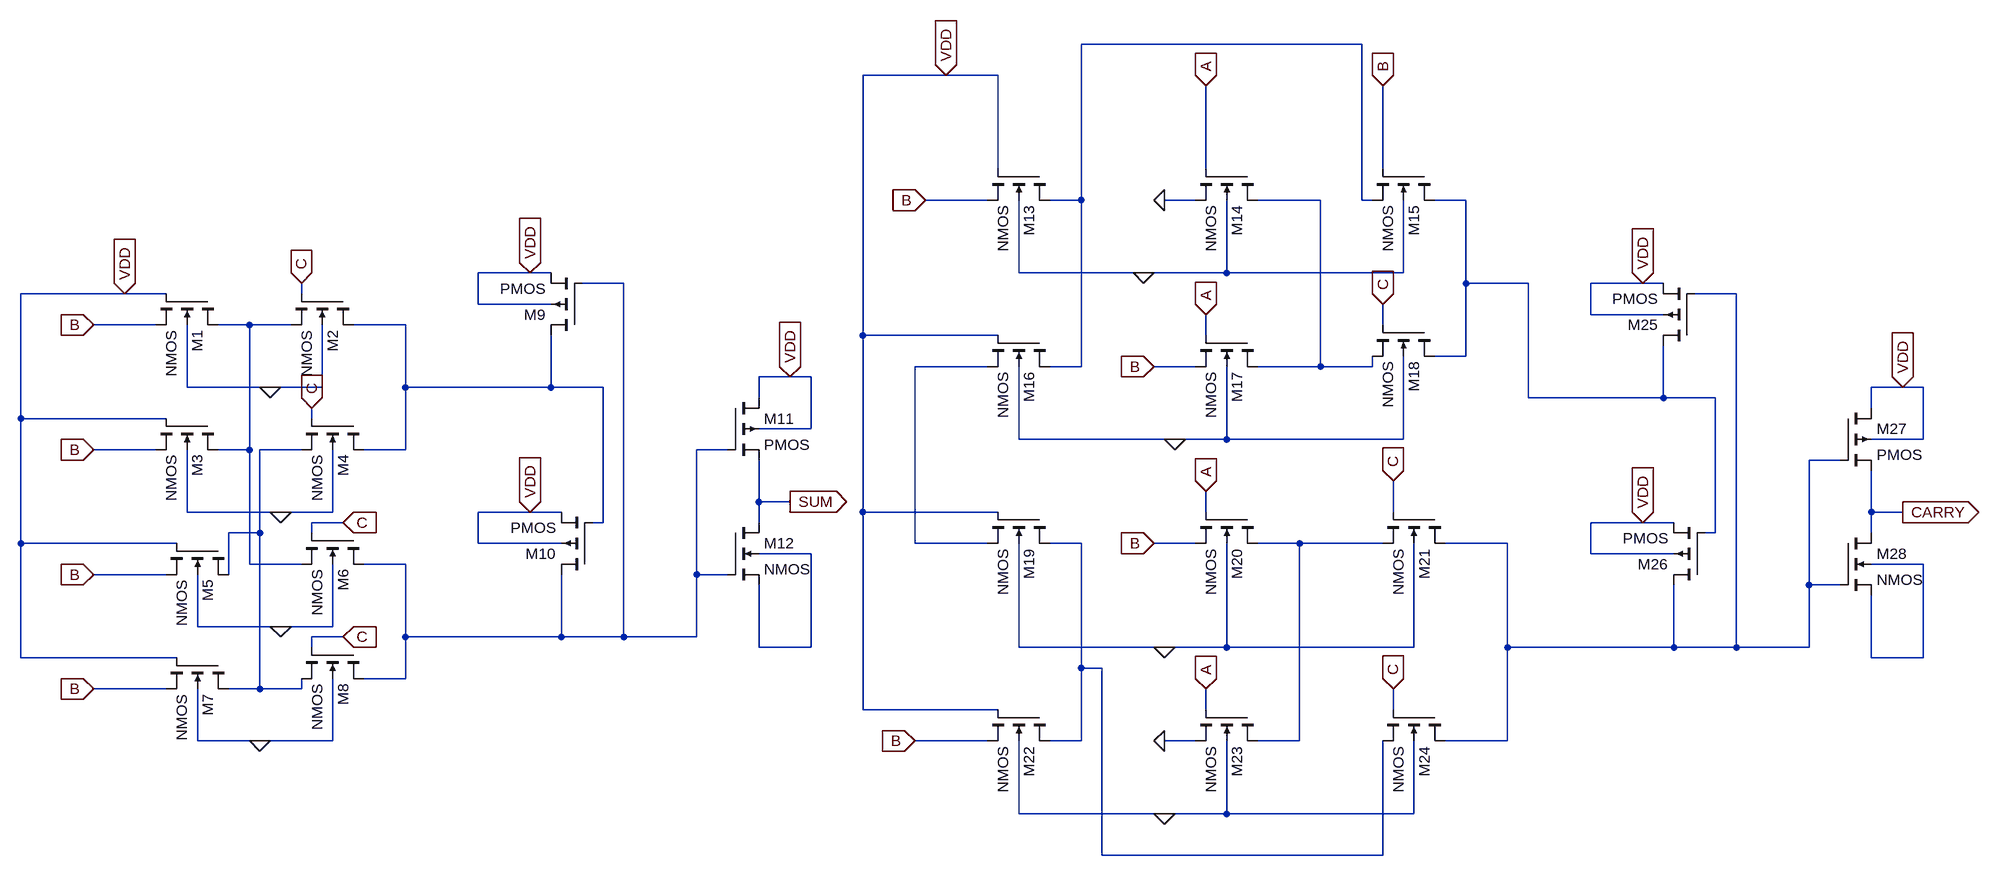
[diagram p0: schematic PTL.asc]
PTL.asc, the LTspice schematic file:
Version 4
SHEET 1 2920 916
WIRE 1968 -336 1536 -336
WIRE 1328 -288 1200 -288
WIRE 1408 -288 1328 -288
WIRE 1408 -144 1408 -288
WIRE 1728 -144 1728 -272
WIRE 2000 -144 2000 -272
WIRE 1392 -96 1296 -96
WIRE 1536 -96 1536 -336
WIRE 1536 -96 1488 -96
WIRE 1712 -96 1664 -96
WIRE 1904 -96 1808 -96
WIRE 1968 -96 1968 -336
WIRE 1984 -96 1968 -96
WIRE 2128 -96 2080 -96
WIRE 688 16 608 16
WIRE 720 16 688 16
WIRE 1440 16 1440 -96
WIRE 1632 16 1440 16
WIRE 1760 16 1760 -96
WIRE 1760 16 1632 16
WIRE 2032 16 2032 -96
WIRE 2032 16 1760 16
WIRE 832 32 768 32
WIRE 2128 32 2128 -96
WIRE 2224 32 2128 32
WIRE 2400 32 2320 32
WIRE 2432 32 2400 32
WIRE 64 48 -96 48
WIRE 128 48 64 48
WIRE 336 48 336 32
WIRE 2544 48 2480 48
WIRE 608 64 608 16
WIRE 720 64 608 64
WIRE 2320 80 2320 32
WIRE 2432 80 2320 80
WIRE 112 96 16 96
WIRE 256 96 208 96
WIRE 320 96 256 96
WIRE 496 96 416 96
WIRE 2000 96 2000 64
WIRE 1200 112 1200 -288
WIRE 1408 112 1200 112
WIRE 1728 112 1728 80
WIRE 2128 144 2128 32
WIRE 2128 144 2080 144
WIRE 1392 160 1280 160
WIRE 1536 160 1536 -96
WIRE 1536 160 1488 160
WIRE 1712 160 1648 160
WIRE 1904 160 1904 -96
WIRE 1904 160 1808 160
WIRE 1984 160 1984 144
WIRE 1984 160 1904 160
WIRE 1088 176 1040 176
WIRE 1120 176 1088 176
WIRE 160 192 160 96
WIRE 288 192 160 192
WIRE 368 192 368 96
WIRE 368 192 288 192
WIRE 496 192 496 96
WIRE 720 192 720 112
WIRE 720 192 496 192
WIRE 800 192 720 192
WIRE 2800 192 2752 192
WIRE 2832 192 2800 192
WIRE 1040 208 1040 176
WIRE 2224 208 2224 32
WIRE 2432 208 2432 128
WIRE 2432 208 2224 208
WIRE 2512 208 2432 208
WIRE 2752 224 2752 192
WIRE -96 240 -96 48
WIRE 128 240 -96 240
WIRE 352 240 352 224
WIRE 1120 256 1120 176
WIRE 1120 256 1040 256
WIRE 1440 272 1440 160
WIRE 1680 272 1440 272
WIRE 1760 272 1760 160
WIRE 1760 272 1680 272
WIRE 2032 272 2032 144
WIRE 2032 272 1760 272
WIRE 2832 272 2832 192
WIRE 2832 272 2752 272
WIRE 112 288 16 288
WIRE 256 288 256 96
WIRE 256 288 208 288
WIRE 336 288 272 288
WIRE 496 288 496 192
WIRE 496 288 432 288
WIRE 992 288 944 288
WIRE 2704 304 2656 304
WIRE 1040 368 1040 304
WIRE 1088 368 1040 368
WIRE 160 384 160 288
WIRE 304 384 160 384
WIRE 384 384 384 288
WIRE 384 384 304 384
WIRE 688 384 608 384
WIRE 736 384 688 384
WIRE 1200 384 1200 112
WIRE 1408 384 1200 384
WIRE 1728 384 1728 352
WIRE 2016 384 2016 336
WIRE 2752 384 2752 320
WIRE 2800 384 2752 384
WIRE 400 400 352 400
WIRE 800 400 800 192
WIRE 800 400 784 400
WIRE 1040 400 1040 368
WIRE 2400 400 2320 400
WIRE 2448 400 2400 400
WIRE 272 416 272 288
WIRE 272 416 224 416
WIRE 352 416 352 400
WIRE 2512 416 2512 208
WIRE 2512 416 2496 416
WIRE 2752 416 2752 384
WIRE -96 432 -96 240
WIRE 144 432 -96 432
WIRE 608 432 608 384
WIRE 736 432 608 432
WIRE 1280 432 1280 160
WIRE 1392 432 1280 432
WIRE 1536 432 1488 432
WIRE 1712 432 1648 432
WIRE 1872 432 1808 432
WIRE 2000 432 1872 432
WIRE 2192 432 2096 432
WIRE 1120 448 1040 448
WIRE 2320 448 2320 400
WIRE 2448 448 2320 448
WIRE 256 464 256 288
WIRE 336 464 256 464
WIRE 496 464 432 464
WIRE 2832 464 2752 464
WIRE 128 480 16 480
WIRE 224 480 224 416
WIRE 944 480 944 288
WIRE 992 480 944 480
WIRE 2656 496 2656 304
WIRE 2704 496 2656 496
WIRE 176 560 176 480
WIRE 304 560 176 560
WIRE 384 560 384 464
WIRE 384 560 304 560
WIRE 400 576 352 576
WIRE 496 576 496 464
WIRE 736 576 736 480
WIRE 736 576 496 576
WIRE 832 576 832 32
WIRE 832 576 736 576
WIRE 944 576 944 480
WIRE 944 576 832 576
WIRE 352 592 352 576
WIRE 1040 592 1040 496
WIRE 1120 592 1120 448
WIRE 1120 592 1040 592
WIRE 1440 592 1440 432
WIRE 1664 592 1440 592
WIRE 1760 592 1760 432
WIRE 1760 592 1664 592
WIRE 2048 592 2048 432
WIRE 2048 592 1760 592
WIRE 2192 592 2192 432
WIRE 2448 592 2448 496
WIRE 2448 592 2192 592
WIRE 2544 592 2544 48
WIRE 2544 592 2448 592
WIRE 2656 592 2656 496
WIRE 2656 592 2544 592
WIRE -96 608 -96 432
WIRE 144 608 -96 608
WIRE 2752 608 2752 512
WIRE 2832 608 2832 464
WIRE 2832 608 2752 608
WIRE 1536 624 1536 432
WIRE 1568 624 1536 624
WIRE 496 640 496 576
WIRE 496 640 432 640
WIRE 128 656 16 656
WIRE 272 656 272 416
WIRE 272 656 224 656
WIRE 336 656 336 640
WIRE 336 656 272 656
WIRE 1200 688 1200 384
WIRE 1408 688 1200 688
WIRE 1728 688 1728 656
WIRE 2016 688 2016 656
WIRE 176 736 176 656
WIRE 272 736 176 736
WIRE 384 736 384 640
WIRE 384 736 272 736
WIRE 1392 736 1280 736
WIRE 1536 736 1536 624
WIRE 1536 736 1488 736
WIRE 1712 736 1664 736
WIRE 1872 736 1872 432
WIRE 1872 736 1808 736
WIRE 2192 736 2192 592
WIRE 2192 736 2096 736
WIRE 1440 848 1440 736
WIRE 1664 848 1440 848
WIRE 1760 848 1760 736
WIRE 1760 848 1664 848
WIRE 2048 848 2048 736
WIRE 2048 848 1760 848
WIRE 1568 912 1568 624
WIRE 2000 912 2000 736
WIRE 2000 912 1568 912
FLAG 1088 368 SUM
IOPIN 1088 368 Out
FLAG 1088 176 VDD
IOPIN 1088 176 In
FLAG 688 384 VDD
IOPIN 688 384 In
FLAG 688 16 VDD
IOPIN 688 16 In
FLAG 288 192 0
FLAG 304 384 0
FLAG 304 560 0
FLAG 1632 16 0
FLAG 1680 272 0
FLAG 1664 592 0
FLAG 1664 848 0
FLAG 1296 -96 B
IOPIN 1296 -96 In
FLAG 1664 -96 0
FLAG 1728 -272 A
IOPIN 1728 -272 In
FLAG 2000 -272 B
IOPIN 2000 -272 In
FLAG 1728 80 A
IOPIN 1728 80 In
FLAG 2000 64 C
IOPIN 2000 64 In
FLAG 1648 432 B
IOPIN 1648 432 In
FLAG 1648 160 B
IOPIN 1648 160 In
FLAG 1728 352 A
IOPIN 1728 352 In
FLAG 2016 336 C
IOPIN 2016 336 In
FLAG 1280 736 B
IOPIN 1280 736 In
FLAG 1664 736 0
FLAG 1728 656 A
IOPIN 1728 656 In
FLAG 2016 656 C
IOPIN 2016 656 In
FLAG 272 736 0
FLAG 400 576 C
IOPIN 400 576 In
FLAG 400 400 C
IOPIN 400 400 In
FLAG 352 224 C
IOPIN 352 224 In
FLAG 336 32 C
IOPIN 336 32 In
FLAG 16 96 B
IOPIN 16 96 In
FLAG 16 288 B
IOPIN 16 288 In
FLAG 16 480 B
IOPIN 16 480 In
FLAG 16 656 B
IOPIN 16 656 In
FLAG 2800 384 CARRY
IOPIN 2800 384 Out
FLAG 2800 192 VDD
IOPIN 2800 192 In
FLAG 2400 400 VDD
IOPIN 2400 400 In
FLAG 2400 32 VDD
IOPIN 2400 32 In
FLAG 1328 -288 VDD
IOPIN 1328 -288 In
FLAG 64 48 VDD
IOPIN 64 48 In
SYMBOL nmos4 208 48 R90
SYMATTR InstName M1
SYMBOL nmos4 416 48 R90
SYMATTR InstName M2
SYMBOL nmos4 208 240 R90
SYMATTR InstName M3
SYMBOL nmos4 432 240 R90
SYMATTR InstName M4
SYMBOL nmos4 224 432 R90
SYMATTR InstName M5
SYMBOL nmos4 432 416 R90
SYMATTR InstName M6
SYMBOL nmos4 224 608 R90
SYMATTR InstName M7
SYMBOL nmos4 432 592 R90
SYMATTR InstName M8
SYMBOL pmos4 768 112 R180
SYMATTR InstName M9
SYMBOL pmos4 784 480 R180
SYMATTR InstName M10
SYMBOL pmos4 992 208 R0
SYMATTR InstName M11
SYMBOL nmos4 992 400 R0
SYMATTR InstName M12
SYMBOL nmos4 1488 -144 R90
SYMATTR InstName M13
SYMBOL nmos4 1808 -144 R90
SYMATTR InstName M14
SYMBOL nmos4 2080 -144 R90
SYMATTR InstName M15
SYMBOL nmos4 1488 112 R90
SYMATTR InstName M16
SYMBOL nmos4 1808 112 R90
SYMATTR InstName M17
SYMBOL nmos4 2080 96 R90
SYMATTR InstName M18
SYMBOL nmos4 1488 384 R90
SYMATTR InstName M19
SYMBOL nmos4 1808 384 R90
SYMATTR InstName M20
SYMBOL nmos4 2096 384 R90
SYMATTR InstName M21
SYMBOL nmos4 1488 688 R90
SYMATTR InstName M22
SYMBOL nmos4 1808 688 R90
SYMATTR InstName M23
SYMBOL nmos4 2096 688 R90
SYMATTR InstName M24
SYMBOL pmos4 2480 128 R180
SYMATTR InstName M25
SYMBOL pmos4 2496 496 R180
SYMATTR InstName M26
SYMBOL pmos4 2704 224 R0
SYMATTR InstName M27
SYMBOL nmos4 2704 416 R0
SYMATTR InstName M28

The netlist it stands for:
* PTL.asc
M1 N006 VDD B 0 NMOS
M2 N007 C N006 0 NMOS
M3 N006 VDD B 0 NMOS
M4 N007 C N009 0 NMOS
M5 N009 VDD B 0 NMOS
M6 N004 C N006 0 NMOS
M7 N009 VDD B 0 NMOS
M8 N004 C N009 0 NMOS
M9 N007 N004 VDD VDD PMOS
M10 N004 N007 VDD VDD PMOS
M11 VDD N004 SUM VDD PMOS
M12 SUM N004 N012 N012 NMOS
M13 N001 VDD B 0 NMOS
M14 N002 A 0 0 NMOS
M15 N003 B N001 0 NMOS
M16 N001 VDD N008 0 NMOS
M17 N002 A B 0 NMOS
M18 N003 C N002 0 NMOS
M19 N010 VDD N008 0 NMOS
M20 N011 A B 0 NMOS
M21 N005 C N011 0 NMOS
M22 N010 VDD B 0 NMOS
M23 N011 A 0 0 NMOS
M24 N005 C N010 0 NMOS
M25 N003 N005 VDD VDD PMOS
M26 N005 N003 VDD VDD PMOS
M27 VDD N005 CARRY VDD PMOS
M28 CARRY N005 N013 N013 NMOS
.model NMOS NMOS
.model PMOS PMOS
.lib standard.mos
.backanno
.end